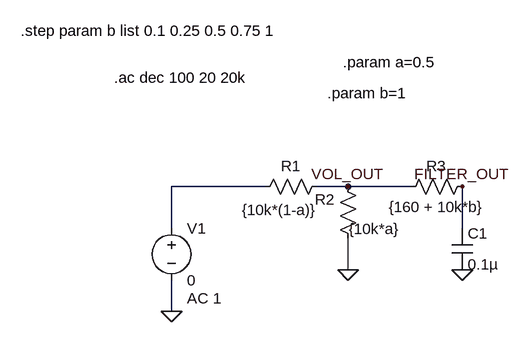
[diagram p0: schematic Deck A passive.asc]
Deck A passive.asc, the LTspice schematic file:
Version 4.1
SHEET 1 880 680
WIRE -32 -96 -176 -96
WIRE 96 -96 48 -96
WIRE 192 -96 96 -96
WIRE -176 -32 -176 -96
WIRE 272 -32 272 -96
WIRE 96 32 96 -16
WIRE -176 96 -176 48
FLAG -176 96 0
FLAG 96 32 0
FLAG 96 -96 VOL_OUT
FLAG 272 32 0
FLAG 272 -96 FILTER_OUT
SYMBOL voltage -176 -48 R0
WINDOW 123 24 124 Left 2
WINDOW 39 0 0 Left 0
SYMATTR InstName V1
SYMATTR Value 0
SYMATTR Value2 AC 1
SYMBOL res 64 -112 R90
WINDOW 0 0 56 VBottom 2
WINDOW 3 36 73 VTop 2
SYMATTR InstName R1
SYMATTR Value {10k*(1-a)}
SYMBOL res 112 0 R180
WINDOW 0 36 76 Left 2
WINDOW 3 -63 31 Left 2
SYMATTR InstName R2
SYMATTR Value {10k*a}
SYMBOL res 288 -112 R90
WINDOW 0 0 56 VBottom 2
WINDOW 3 32 56 VTop 2
SYMATTR InstName R3
SYMATTR Value {160 + 10k*b}
SYMBOL cap 256 -32 R0
SYMATTR InstName C1
SYMATTR Value 0.1µ
TEXT -264 -264 Left 2 !.ac dec 100 20 20k
TEXT 88 -288 Left 2 !.param a=0.5
TEXT 64 -240 Left 2 !.param b=1
TEXT -408 -336 Left 2 !.step param b list 0.1 0.25 0.5 0.75 1

The netlist it stands for:
* Deck A passive.asc
V1 N001 0 0 AC 1
R1 VOL_OUT N001 {10k*(1-a)}
R2 0 VOL_OUT {10k*a}
R3 FILTER_OUT VOL_OUT {160 + 10k*b}
C1 FILTER_OUT 0 0.1µ
.ac dec 100 20 20k
.param a=0.5
.param b=1
.step param b list 0.1 0.25 0.5 0.75 1
.backanno
.end